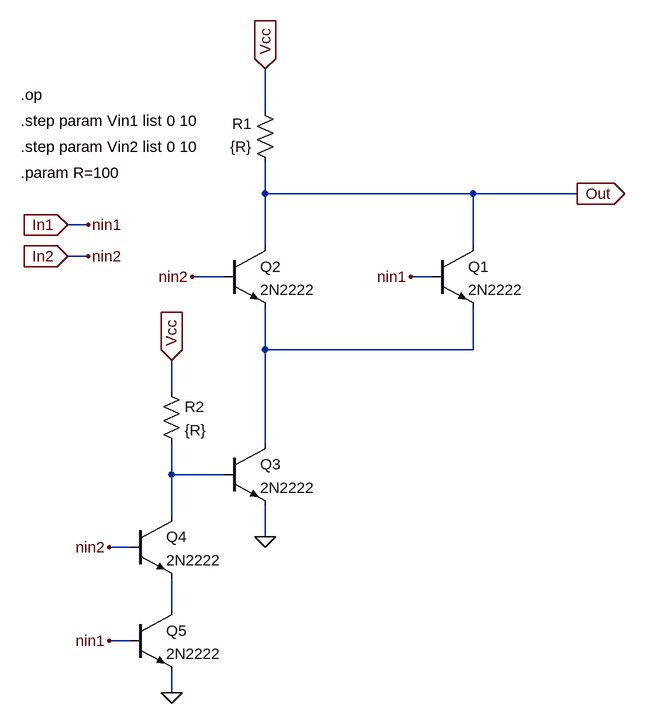
[diagram p0: schematic XorGate.asc]
XorGate.asc, the LTspice schematic file:
Version 4
SHEET 1 880 756
WIRE 176 -240 176 -304
WIRE 176 -112 176 -160
WIRE 496 -112 176 -112
WIRE 656 -112 496 -112
WIRE -96 -64 -128 -64
WIRE 176 -32 176 -112
WIRE 496 -32 496 -112
WIRE -96 -16 -128 -16
WIRE 112 16 64 16
WIRE 432 16 400 16
WIRE 176 128 176 64
WIRE 496 128 496 64
WIRE 496 128 176 128
WIRE 32 192 32 144
WIRE 176 272 176 128
WIRE 32 320 32 272
WIRE 112 320 32 320
WIRE 32 384 32 320
WIRE 176 416 176 368
WIRE -32 432 -64 432
WIRE 32 528 32 480
WIRE -32 576 -64 576
WIRE 32 656 32 624
FLAG 656 -112 Out
IOPIN 656 -112 Out
FLAG 400 16 nin1
FLAG 64 16 nin2
FLAG 176 416 0
FLAG -128 -16 In2
IOPIN -128 -16 In
FLAG -128 -64 In1
IOPIN -128 -64 In
FLAG 176 -304 Vcc
IOPIN 176 -304 In
FLAG 32 144 Vcc
IOPIN 32 144 In
FLAG 32 656 0
FLAG -64 432 nin2
FLAG -64 576 nin1
FLAG -96 -16 nin2
FLAG -96 -64 nin1
SYMBOL res 192 -144 R180
WINDOW 0 36 76 Left 2
WINDOW 3 36 40 Left 2
SYMATTR InstName R1
SYMATTR Value {R}
SYMBOL res 16 176 R0
SYMATTR InstName R2
SYMATTR Value {R}
SYMBOL npn 112 -32 R0
SYMATTR InstName Q2
SYMATTR Value 2N2222
SYMBOL npn 432 -32 R0
SYMATTR InstName Q1
SYMATTR Value 2N2222
SYMBOL npn 112 272 R0
SYMATTR InstName Q3
SYMATTR Value 2N2222
SYMBOL npn -32 384 R0
SYMATTR InstName Q4
SYMATTR Value 2N2222
SYMBOL npn -32 528 R0
SYMATTR InstName Q5
SYMATTR Value 2N2222
TEXT -200 -144 Left 2 !.param R=100
TEXT -200 -224 Left 2 !.step param Vin1 list 0 10
TEXT -200 -184 Left 2 !.step param Vin2 list 0 10
TEXT -200 -264 Left 2 !.op

The netlist it stands for:
* XorGate.asc
R1 Out Vcc {R}
R2 Vcc N002 {R}
Q2 Out In2 N001 0 2N2222
Q1 Out In1 N001 0 2N2222
Q3 N001 N002 0 0 2N2222
Q4 N002 In2 N003 0 2N2222
Q5 N003 In1 0 0 2N2222
.model NPN NPN
.model PNP PNP
.lib standard.bjt
.param R=100
.step param Vin1 list 0 10
.step param Vin2 list 0 10
.op
.backanno
.end